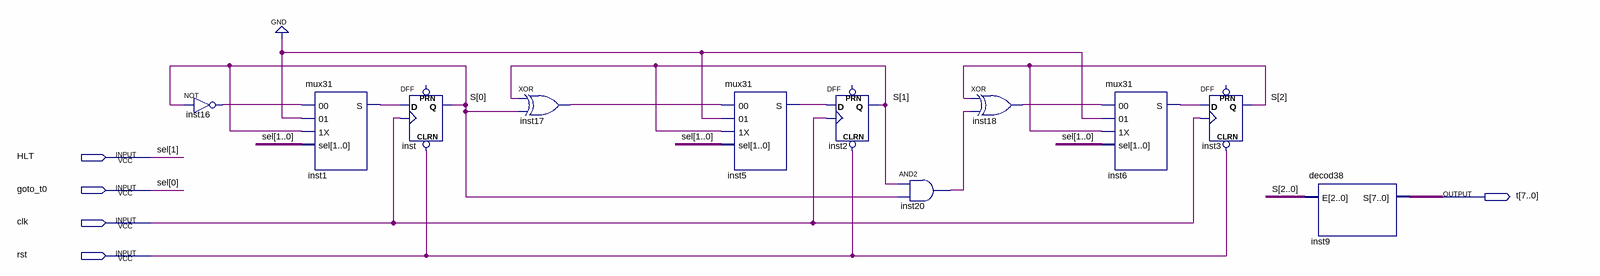
[diagram p0: schematic sheet]
// Quartus schematic temporizer.bdf as structural Verilog: 11 symbols, 5 pins
module temporizer (
  input  HLT,
  input  goto_t0,
  input  clk,
  input  rst,
  output [7:0] t
);

  wire inst1_s, inst5_s, inst6_s, inst16_out, inst17_out, inst18_out, inst20_out;
  wire [2:0] S;

  not inst16 (inst16_out, S[0]);
  mux31 inst1 (.\00 (inst16_out), .\01 (1'b0), .\1X (S[0]), .sel({HLT, goto_t0}), .S(inst1_s));
  DFF inst (.CLRN(rst), .CLK(clk), .D(inst1_s), .Q(S[0]));  // open: PRN
  xor inst17 (inst17_out, S[1], S[0]);
  mux31 inst5 (.\00 (inst17_out), .\01 (1'b0), .\1X (S[1]), .sel({HLT, goto_t0}), .S(inst5_s));
  DFF inst2 (.CLRN(rst), .CLK(clk), .D(inst5_s), .Q(S[1]));  // open: PRN
  and inst20 (inst20_out, S[1], S[0]);
  xor inst18 (inst18_out, S[2], inst20_out);
  mux31 inst6 (.\00 (inst18_out), .\01 (1'b0), .\1X (S[2]), .sel({HLT, goto_t0}), .S(inst6_s));
  DFF inst3 (.CLRN(rst), .CLK(clk), .D(inst6_s), .Q(S[2]));  // open: PRN
  decod38 inst9 (.E(S), .S(t));

  // Other names for the same wires on the sheet: sel[1:0] = {HLT, goto_t0}
endmodule
